# Altium project PCB_Project.PrjPcb
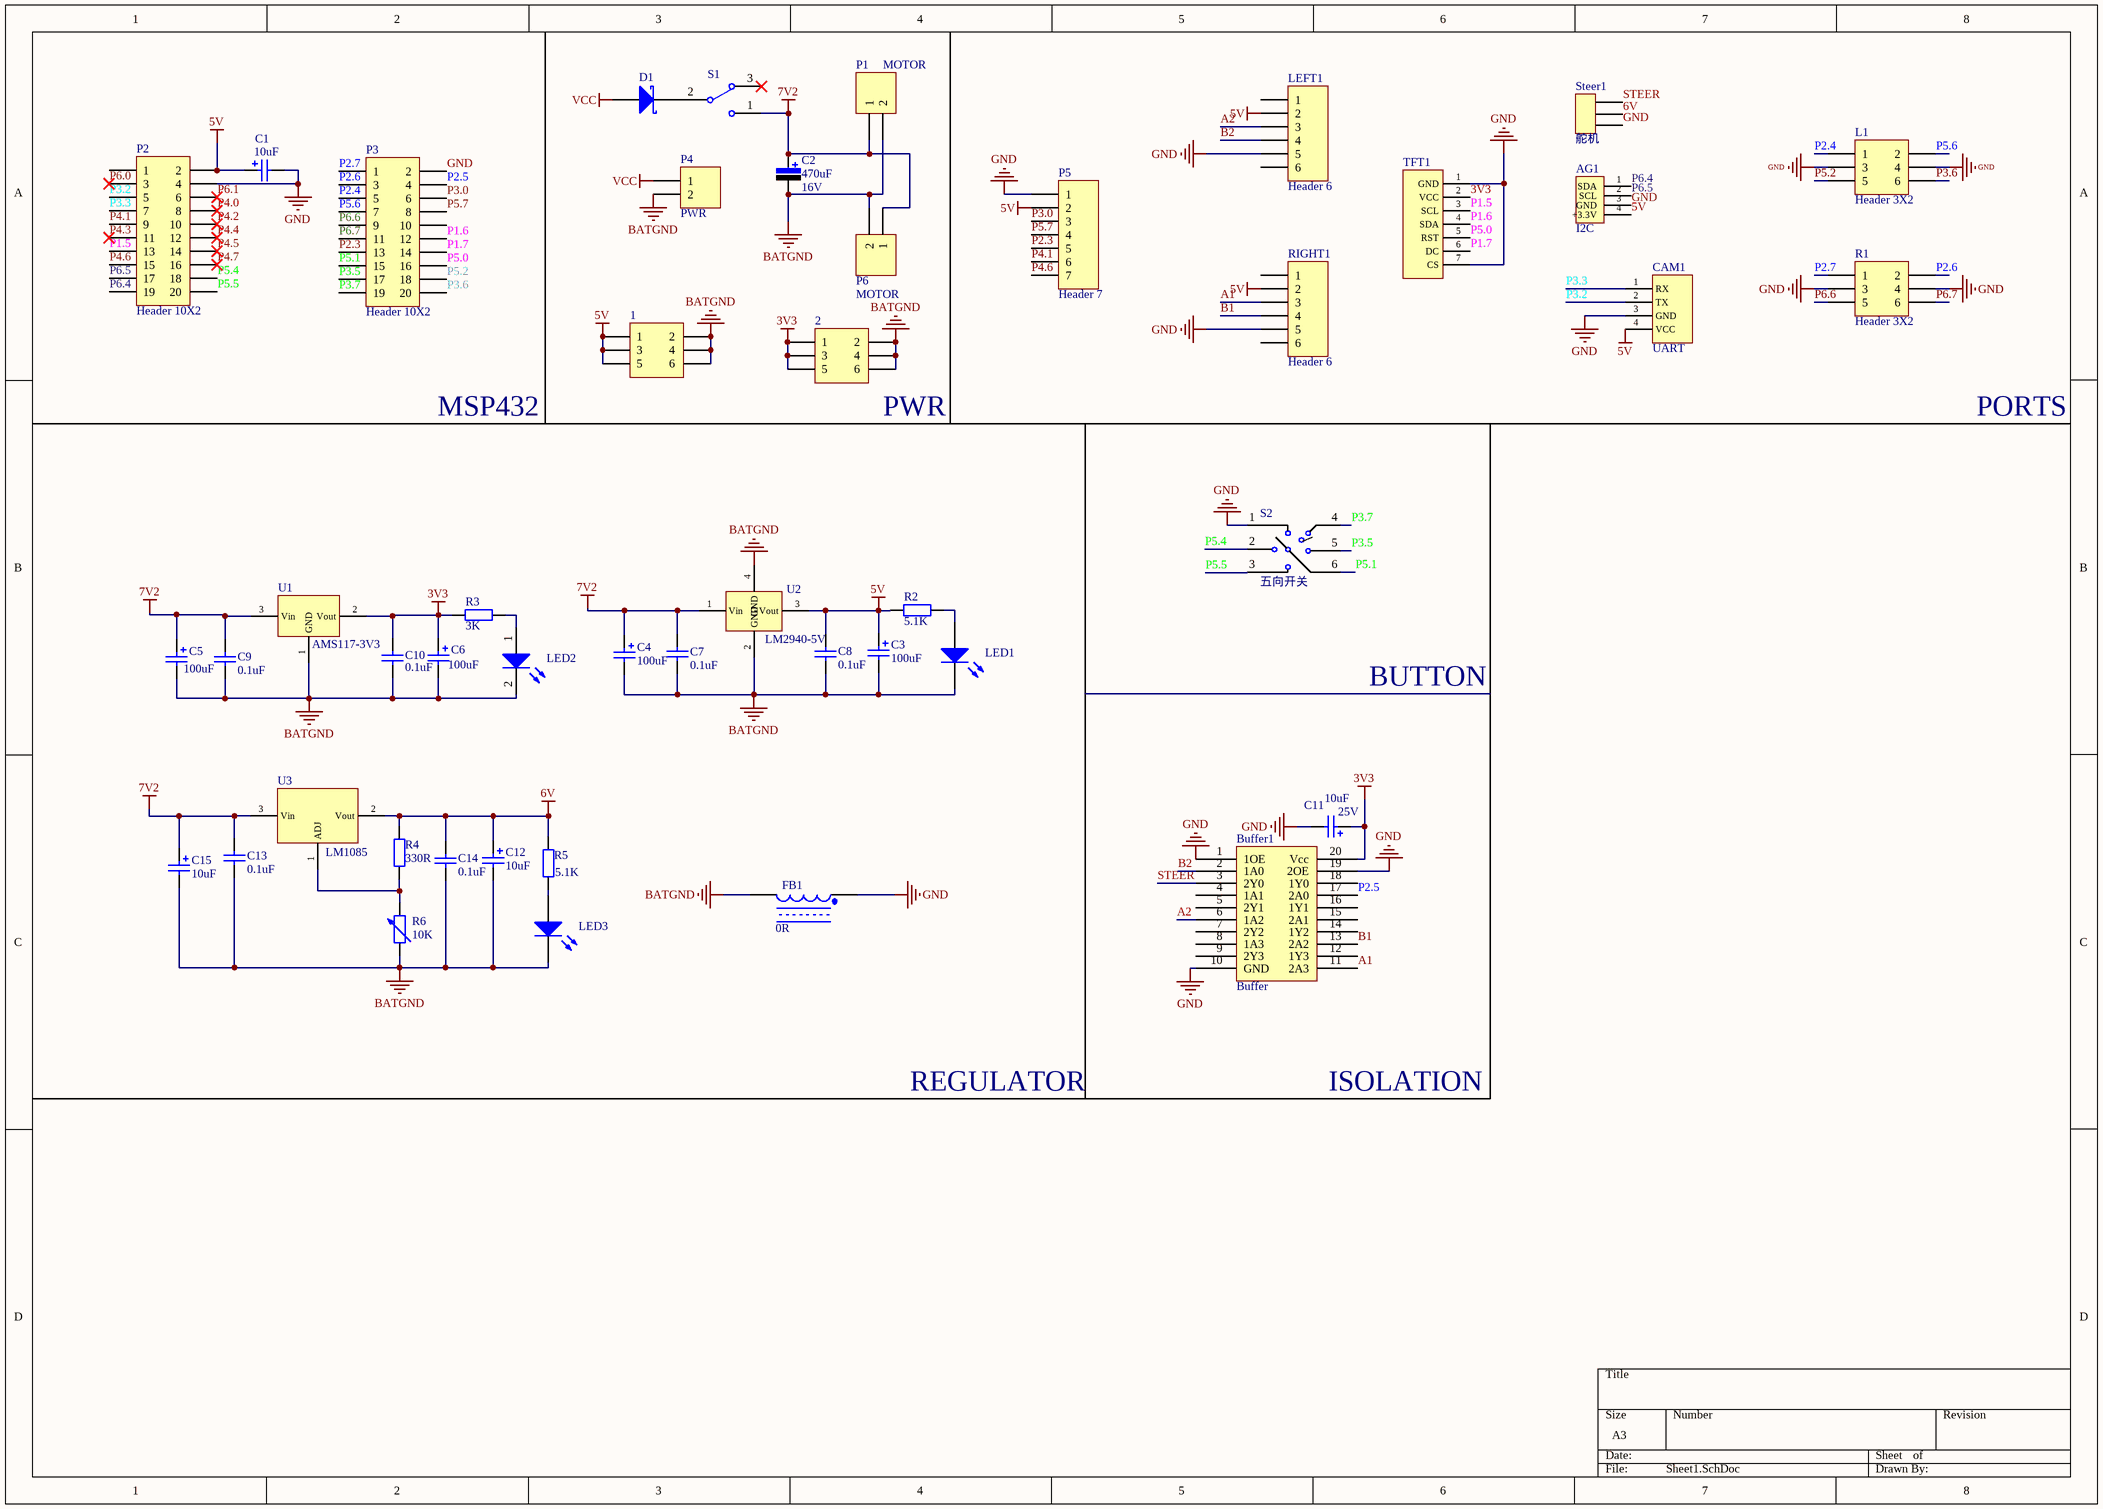
[diagram p0: Sheet1.SchDoc]
1 sheet, 47 parts. Net scope: global (net labels, ports and power ports of the same name join across sheets).
Board file: MSP432P401R_v1.0.PcbDoc

## Sheet Sheet1.SchDoc
size A3; SheetNumber: 1; SheetTotal: 1

### Parts
1  Header 3X2  [HDR2X3]  (value not drawn)
2  Header 3X2  [HDR2X3]  (value not drawn)
AG1  I2C  [HDR1X4]
Buffer1  Buffer  [TSSOP_20]
C1  value 10uF  [CAP-3528]  (hidden comment: 25V)
C2  value 470uF  Vol: 16V  [CE E(8*10.2)]  (hidden comment: Cap Pol)
C3  value 100uF  [CAP-3528]  (hidden comment: Cap Pol2)
C4  value 100uF  [CAP-3528]  (hidden comment: Cap Pol2)
C5  value 100uF  [CAP-3528]  (hidden comment: Cap Pol2)
C6  value 100uF  [CAP-3528]  (hidden comment: Cap Pol2)
C7  value 0.1uF  [CAP-0603]  (hidden comment: Cap)
C8  value 0.1uF  [CAP-0603]  (hidden comment: Cap)
C9  value 0.1uF  [CAP-0603]  (hidden comment: Cap)
C10  value 0.1uF  [CAP-0603]  (hidden comment: Cap)
C11  25V  value 10uF  [CAP-3528]
C12  value 10uF  [CAP-3528]  (hidden comment: Cap Pol2)
C13  value 0.1uF  [CAP-0603]  (hidden comment: Cap)
C14  value 0.1uF  [CAP-0603]  (hidden comment: Cap)
C15  value 10uF  [CAP-3528]  (hidden comment: Cap Pol2)
CAM1  UART  [HDR1X4]
D1  D Schottky  [DIODE-SMA]  (value not drawn)
FB1  0R  [CAP-1206]
L1  Header 3X2  [2x3牛角座]
LED1  LED  [0805]  (value not drawn)
LED2  LED  [0805]  (value not drawn)
LED3  LED  [0805]  (value not drawn)
LEFT1  Header 6  [XH2.54-LI-6P]
P1  MOTOR  [VCC_CON]
P2  Header 10X2  [HDR2X10]
P3  Header 10X2  [HDR2X10]
P4  PWR  [VCC_CON]
P5  Header 7  [HDR1X7]
P6  MOTOR  [VCC_CON]
R1  Header 3X2  [2x3牛角座]
R2  value 5.1K  [RES_0603]  (hidden comment: Res2)
R3  value 3K  [RES_0603]  (hidden comment: Res2)
R4  330R  [RES_0603]
R5  value 5.1K  [RES_0603]  (hidden comment: Res2)
R6  10K  [3296W]
RIGHT1  Header 6  [XH2.54-LI-6P]
S1  SW-3-3  [SWITCH-3-3]  (value not drawn)
S2  五向开关  [五向按键（贴片）]
Steer1  舵机  [HDR1X3]
TFT1  Component_1  [HDR1X8]  (value not drawn)
U1  AMS117-3V3  [SOT-223]
U2  LM2940-5V  [LM2940-5.0]
U3  LM1085  [LM2940-5.0]

### Nets
3V3: 2.1 2.3 2.5 Buffer1.20(Vcc) C6.1 C10.2 C11.1 R3.2 TFT1.2(VCC) U1.2(Vout)
5V: 1.1 1.3 1.5 AG1.4(+3.3V) C1.1 C3.1 C8.2 CAM1.4(VCC) LEFT1.2 P2.2 P5.2 R2.2 RIGHT1.2 U2.3(Vout)
6V: C12.1 C14.2 R4.2 R5.2 Steer1.2(VCC) U3.2(Vout)
7V2: C2.1 C4.1 C5.1 C7.2 C9.2 C13.2 C15.1 P1.1 P6.1 S1.1 U1.3(Vin) U2.1(Vin) U3.3(Vin)
BATGND: 1.2 1.4 1.6 2.2 2.4 2.6 C2.2 C3.2 C4.2 C5.2 C6.2 C7.1 C8.1 C9.1 C10.1 C12.2 C13.1 C14.1 C15.2 FB1.2 LED1.2(K) LED2.2(K) LED3.2(K) P1.2 P4.2 P6.2 R6.1 U1.1(GND) U2.2(GND) U2.4(GND)
GND: AG1.3(GND) Buffer1.1(1OE) Buffer1.10(GND) Buffer1.19(2OE) C1.2 C11.2 CAM1.3(GND) FB1.1 L1.3 L1.4 LEFT1.5 P2.4 P3.2 P5.1 R1.3 R1.4 RIGHT1.5 S2.1 Steer1.3 TFT1.1(GND) TFT1.7(CS)
VCC: D1.1(A) P4.1
A1: Buffer1.11(2A3) RIGHT1.3
A2: Buffer1.6(1A2) LEFT1.3
B1: Buffer1.13(2A2) RIGHT1.4
B2: Buffer1.2(1A0) LEFT1.4
P1.5: P2.13 TFT1.3(SCL)
P1.6: P3.12 TFT1.4(SDA)
P1.7: P3.14 TFT1.6(DC)
P2.3: P3.13 P5.5
P2.4: L1.1 P3.5
P2.5: Buffer1.17(2A0) P3.4
P2.6: P3.3 R1.2
P2.7: P3.1 R1.1
P3.0: P3.6 P5.3
P3.2: CAM1.2(TX) P2.5
P3.3: CAM1.1(RX) P2.7
P3.5: P3.17 S2.5
P3.6: L1.6 P3.20
P3.7: P3.19 S2.4
P4.0: P2.8
P4.1: P2.9 P5.6
P4.2: P2.10
P4.3: P2.11
P4.4: P2.12
P4.5: P2.14
P4.6: P2.15 P5.7
P4.7: P2.16
P5.0: P3.16 TFT1.5(RST)
P5.1: P3.15 S2.6
P5.2: L1.5 P3.18
P5.4: P2.18 S2.2
P5.5: P2.20 S2.3
P5.6: L1.2 P3.7
P5.7: P3.8 P5.4
P6.0: P2.3
P6.1: P2.6
P6.4: AG1.1(SDA) P2.19
P6.5: AG1.2(SCL) P2.17
P6.6: P3.9 R1.5
P6.7: P3.11 R1.6
STEER: Buffer1.3(2Y0) Steer1.1
NetD1_2: D1.2(K) S1.2
NetLED1_1: LED1.1(A) R2.1
NetLED2_1: LED2.1(A) R3.1
NetLED3_1: LED3.1(A) R5.1
NetR4_1: R4.1 R6.2 U3.1(ADJ)

Not connected (* = marked no-connect by the designer): Buffer1 4(1A1) 5(2Y1) 7(2Y2) 8(1A3) 9(2Y3) 12(1Y3) 14(1Y2) 15(2A1) 16(1Y1) 18(1Y0); LEFT1 1 6; P2 1; P3 10; RIGHT1 1 6; S1 3*

### Notes on the sheet
- MSP432
- (near 2) PWR
- PORTS
- BUTTON
- REGULATOR
- ISOLATION

### Library data of the parts
1 2 L1 R1 = Header 3X2: Header, 3-Pin, Dual row; LatestRevisionDate: 17-Jul-2002; LatestRevisionNote: Re-released for DXP Platform.; Publisher: Altium Limited
AG1 = 12C
C1 C3-C6 C11 C12 C15 = Cap Pol2: Polarized Capacitor (Axial); Published: 8-Jun-2000; LatestRevisionDate: 17-Jul-2002; LatestRevisionNote: Re-released for DXP Platform.; PackageReference: POLAR0.8; Publisher: Altium Limited; PackageDescription: Polarized Capacitor; 2 Leads
C2 = Cap Pol: 极性电解电容; Published: 8-Jun-2000; LatestRevisionDate: 17-Jul-2002; LatestRevisionNote: Re-released for DXP Platform.; PackageReference: RB7.6-15; Publisher: Altium Limited
C7-C10 C13 C14 = Cap: Capacitor; Published: 8-Jun-2000; LatestRevisionDate: 17-Jul-2002; LatestRevisionNote: Re-released for DXP Platform.; PackageReference: RAD-0.3; Publisher: Altium Limited; PackageDescription: Radial Cap, Thru-Hole; 2 Leads; 0.3 in Pin Spacing
D1 = D Schottky: Schottky Diode; Published: 8-Jun-2000; LatestRevisionDate: 17-Jul-2002; LatestRevisionNote: Re-released for DXP Platform.; PackageReference: SMB; Publisher: Altium Limited; PackageDescription: DO-214-AA/SMB; 2 C-Bend Leads; Body 5.3 x 3.6 mm, inc. leads (LxW); Code_JEDEC: DO-214-AA
FB1 = Inductor Isolated: Inductor Isolated六孔磁珠
LED1-LED3 = LED0: Typical INFRARED GaAs LED; Published: 8-Jun-2000; LatestRevisionDate: 08-Jul-2005; LatestRevisionNote: Mech Layer 1 removed.; PackageReference: LED-0; Publisher: Altium Limited; PackageDescription: LED; 2 Leads
LEFT1 RIGHT1 = Header 6: Header, 6-Pin; LatestRevisionDate: 17-Jul-2002; LatestRevisionNote: Re-released for DXP Platform.; Publisher: Altium Limited
P1 P4 P6 = Header 2H: Header, 2-Pin, Right Angle; LatestRevisionDate: 17-Jul-2002; LatestRevisionNote: Re-released for DXP Platform.; Publisher: Altium Limited
P2 P3 = Header 10X2: Header, 10-Pin, Dual row; LatestRevisionDate: 17-Jul-2002; LatestRevisionNote: Re-released for DXP Platform.; Publisher: Altium Limited
P5 = Header 7: Header, 7-Pin; LatestRevisionDate: 17-Jul-2002; LatestRevisionNote: Re-released for DXP Platform.; Publisher: Altium Limited
R2 R3 R5 = Res2: Resistor; Published: 8-Jun-2000; LatestRevisionDate: 17-Jul-2002; LatestRevisionNote: Re-released for DXP Platform.; PackageReference: AXIAL-0.4; Publisher: Altium Limited; PackageDescription: Axial Device, Thru-Hole; 2 Leads; 0.4 in Pin Spacing
R4 = Res2: Resistor; Value: 1K; Published: 8-Jun-2000; LatestRevisionDate: 17-Jul-2002; LatestRevisionNote: Re-released for DXP Platform.; PackageReference: AXIAL-0.4; Publisher: Altium Limited; PackageDescription: Axial Device, Thru-Hole; 2 Leads; 0.4 in Pin Spacing
R6 = Res Adj2: Variable Resistor; Value: 1K; Set Position: 0.5; Published: 8-Jun-2000; LatestRevisionDate: 17-Jul-2002; LatestRevisionNote: Re-released for DXP Platform.; PackageReference: AXIAL-0.6; Publisher: Altium Limited; PackageDescription: Axial Device, Thru-Hole; 2 Leads; 0.6 in Pin Spacing
S1 = SW-SPDT: SPDT Subminiature Toggle Switch, Right Angle Mounting, Vertical Actuation; Published: 24-Mar-1999; LatestRevisionDate: 17-Dec-2003; LatestRevisionNote: Schematic revised, PCB Footprint replaced.; DatasheetVersion: 05-Dec-2000; PackageReference: TL36WW15050; Publisher: Altium Limited; PackageDescription: Switch; 4 Leads; ComponentLink1Description: Manufacturer Link; ComponentLink1URL: http://www.apem.com
U1 = AMS1117-3V3
U2 = LM2940